# Altium schematic sheet MCU_REVB_0.SchDoc: Big-MCU
size 270 x 223 mm; Origin: Eagle; Date: 2023-01-13 8:42:14 AM; SheetNumber: 1; GateName_1: G$1; SymbolName_1: LETTER_L; LibraryName: frames; DeviceSetName: LETTER_L; GateName_2: G$2; SymbolName_2: DOCFIELD; Sheet: Sheet:; REV: REV:
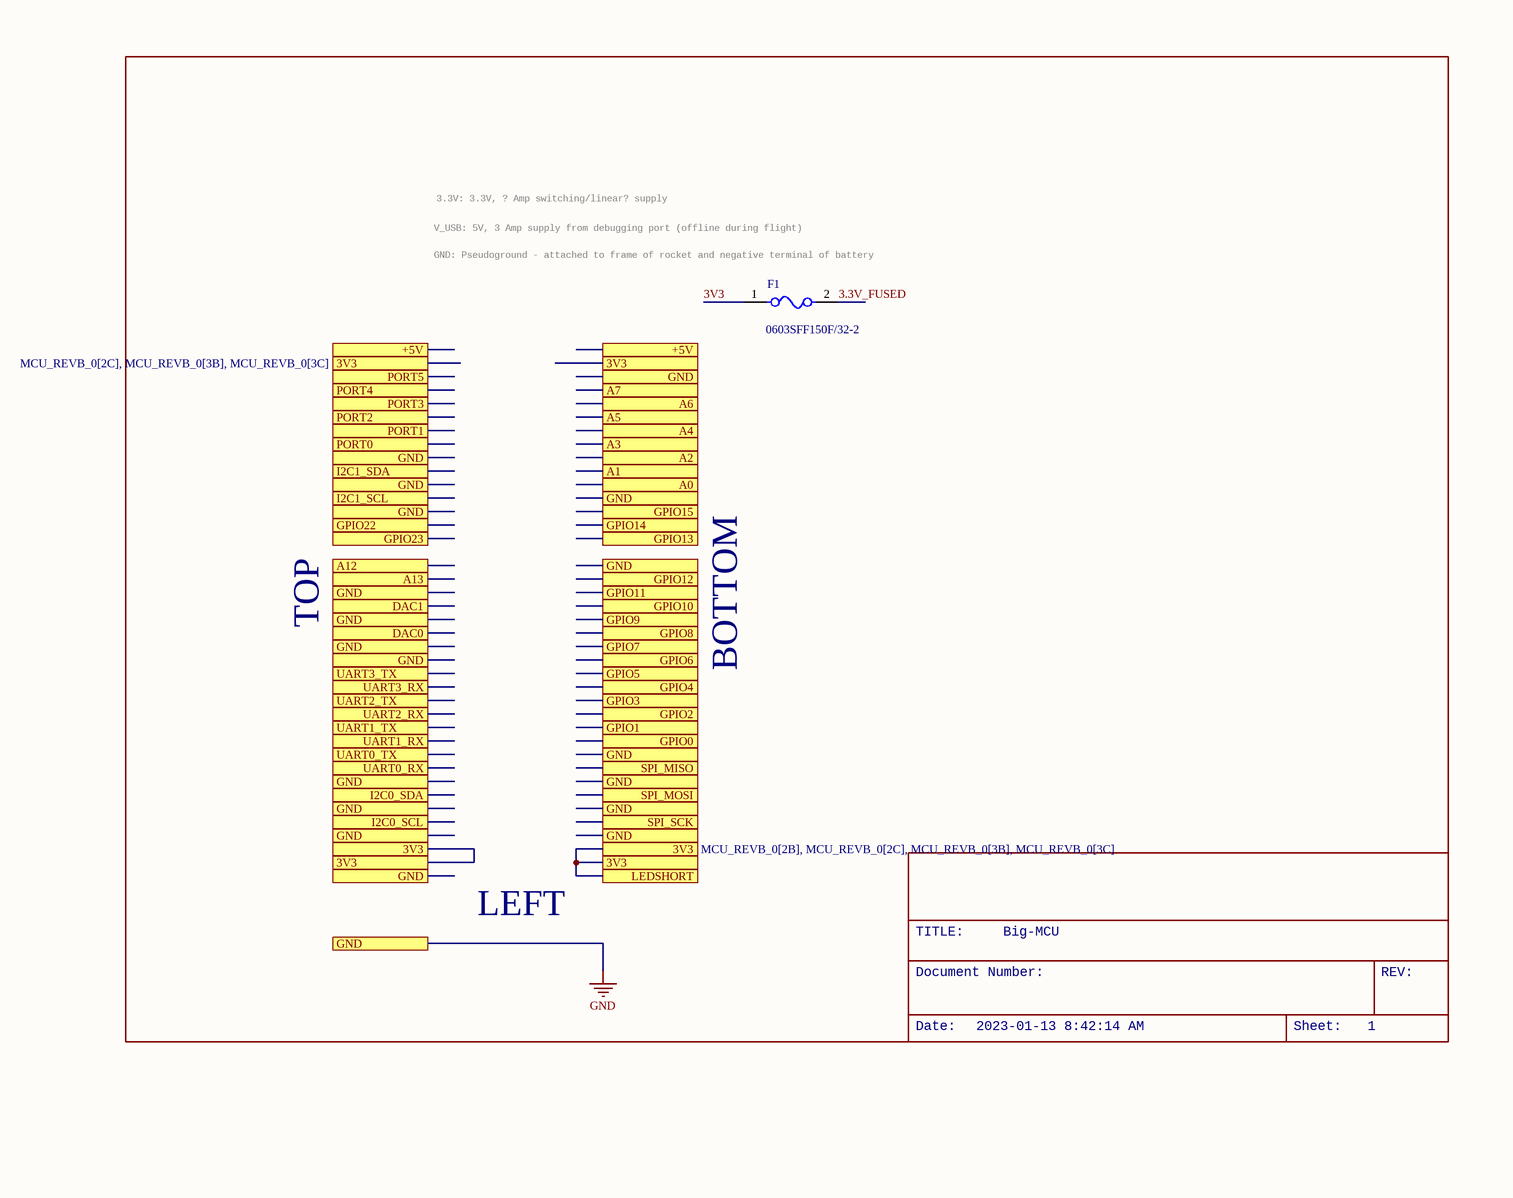
[diagram p0: MCU_REVB_0.SchDoc]

## Parts
F1  0603SFF150F/32-2  [RESC1608X10N]

## Ports
3V3 (see MCU_REVB_0[2B], MCU_REVB_0[2C], MCU_REVB_0[3B], MCU_REVB_0[3C]), 3V3 (see MCU_REVB_0[2B], MCU_REVB_0[2C], MCU_REVB_0[3C]), 3V3 (see MCU_REVB_0[2C], MCU_REVB_0[3B], MCU_REVB_0[3C]), +5V (see MCU_REVB_0[2B]), +5V (see MCU_REVB_0[3B]), A0, A1, A2, A3, A4, A5, A6, A7, A12, A13, DAC0, DAC1, GND (see MCU_REVB_0[2B], MCU_REVB_0[2C], MCU_REVB_0[2D], MCU_REVB_0[3B], MCU_REVB_0[3C]), GND (see MCU_REVB_0[2B], MCU_REVB_0[2C], MCU_REVB_0[3B], MCU_REVB_0[3C]), GPIO0, GPIO1, GPIO2, GPIO3, GPIO4, GPIO5, GPIO6, GPIO7, GPIO8, GPIO9, GPIO10, GPIO11, GPIO12, GPIO13, GPIO14, GPIO15, GPIO22, GPIO23, I2C0_SCL, I2C0_SDA, I2C1_SCL, I2C1_SDA, LEDSHORT, PORT0, PORT1, PORT2, PORT3, PORT4, PORT5, SPI_MISO, SPI_MOSI, SPI_SCK, UART0_RX, UART0_TX, UART1_RX, UART1_TX, UART2_RX, UART2_TX, UART3_RX, UART3_TX

## Nets
GND: port GND
3.3V_FUSED: F1.2
3V3: F1.1
3V3: port 3V3, port LEDSHORT  [a separate net that carries the same name]

## Notes on the sheet
- 3.3V: 3.3V, ? Amp switching/linear? supply
- V_USB: 5V, 3 Amp supply from debugging port (offline during flight)
- (near F1) GND: Pseudoground - attached to frame of rocket and negative terminal of battery
- TOP
- BOTTOM
- LEFT
- TITLE:
- Big-MCU
- Document Number:
- REV:
- Date:
- 2023-01-13 8:42:14 AM
- Sheet:
- 1

## Library data of the parts
F1 = CMP-00019-1: 0603SFF Series - 0603 Size Lead-Free, Halogen Free, Fast-Acting Chip Fuse, 1.5 A, 63 VDC, RoHS; Approvals: UL; Fuse Type: Board Mount (Cartridge Style Excluded); DC Cold Resistance: 175mR; Current Rating: 500mA; Value: 175mR; Voltage Rating: 50V; Case/Package: 0603; Pins: 2; Mounting Technology: Surface Mount; Case Code (Metric): 1608; Fuse Current: 500mA; Reach SVHC Compliant: Yes; Series: SF-0603S; Width: 0.8mm; Max Operating Temperature: 105°C; Packaging: Tape and Reel; Depth: 0.8mm; Min Operating Temperature: -20°C; RoHS Compliant: Yes; Package Quantity: 10000; Height: 0.45mm; Length: 1.6mm; Current: 500mA; Case Code (Imperial): 0603; Contact Plating: Tin; Voltage Rating (DC): 50V; Termination: SMD/SMT